# Altium schematic sheet Mother_Board.SchDoc
size A4; SheetNumber: 2; SheetTotal: 2
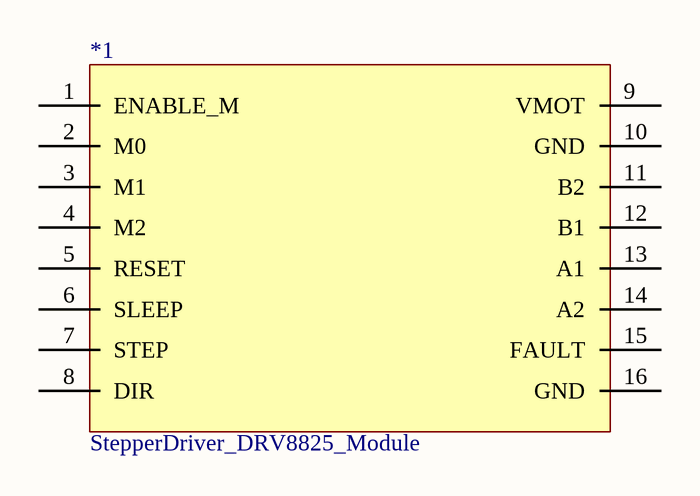
[diagram p0: Mother_Board.SchDoc]

## Parts
*1  StepperDriver_DRV8825_Module  [StepperDriver_DRV8825_Module]

## Nets

Not connected (* = marked no-connect by the designer): *1 1(ENABLE_M) 2(M0) 3(M1) 4(M2) 5(RESET) 6(SLEEP) 7(STEP) 8(DIR) 9(VMOT) 10(GND) 11(B2) 12(B1) 13(A1) 14(A2) 15(FAULT) 16(GND)